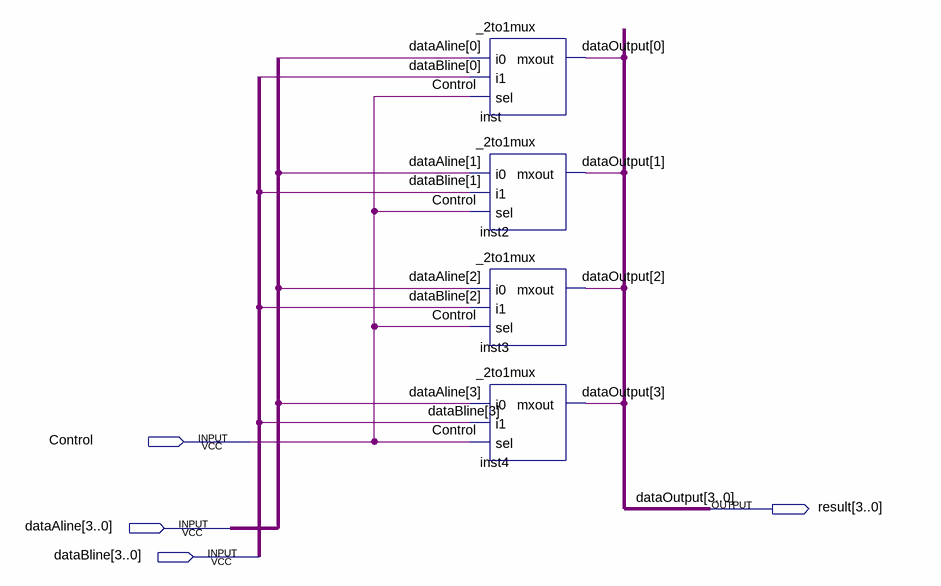
[diagram p0: schematic sheet]
// Quartus schematic 4WideBusMux.bdf as structural Verilog: 4 symbols, 4 pins
module \4WideBusMux  (
  input  Control,
  input  [3:0] dataAline,
  input  [3:0] dataBline,
  output [3:0] result
);

  _2to1mux inst (.i0(dataAline[0]), .i1(dataBline[0]), .sel(Control), .mxout(result[0]));
  _2to1mux inst2 (.i0(dataAline[1]), .i1(dataBline[1]), .sel(Control), .mxout(result[1]));
  _2to1mux inst3 (.i0(dataAline[2]), .i1(dataBline[2]), .sel(Control), .mxout(result[2]));
  _2to1mux inst4 (.i0(dataAline[3]), .i1(dataBline[3]), .sel(Control), .mxout(result[3]));

  // Other names for the same wires on the sheet: dataOutput[3:0] = result
endmodule
